# EAGLE design IR_ARRAY_IMG (EAGLE 7.7.0)

## Sheet 1 of 2
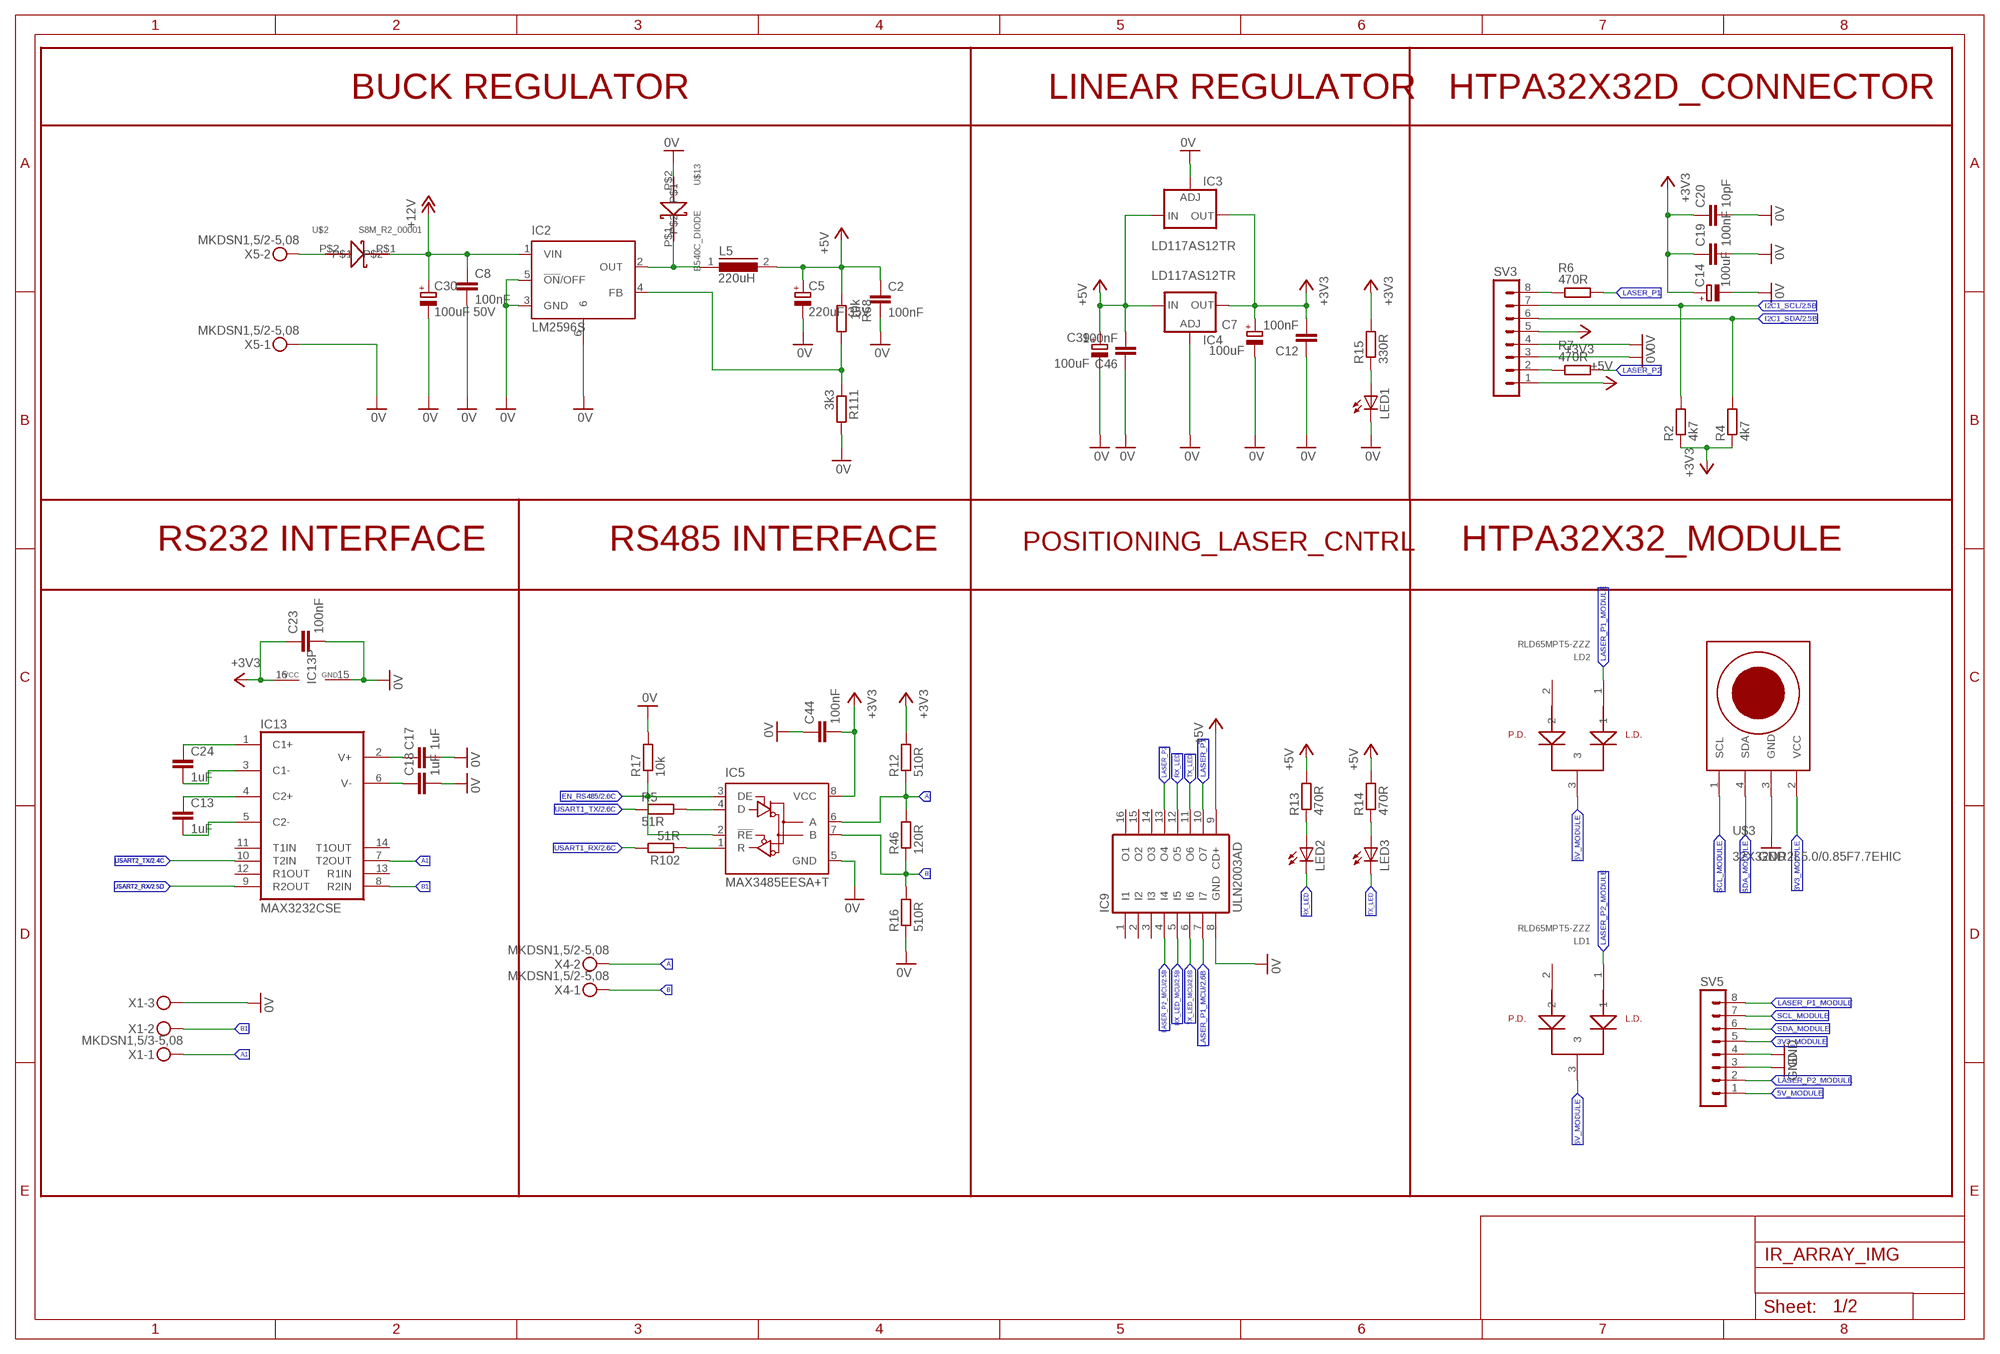
[diagram p0: schematic, sheet 1]

### Parts
C2  100nF  C-EUC0805  [C0805]
C5  220uF 35V  CPOL-EU153CLV-0810  [153CLV-0810]
C7  100uF  CPOL-EU153CLV-0605  [153CLV-0605]
C8  100nF  C-EUC0805  [C0805]
C12  100nF  C-EUC0603  [C0603]
C13  1uF  C-EUC1206  [C1206]
C14  100uF  CPOL-EUC/6032-28R  [C/6032-28R]
C17  1uF  C-EUC1206  [C1206]
C18  1uF  C-EUC1206  [C1206]
C19  100nF  C-EUC0603  [C0603]
C20  10pF  C-EUC0603  [C0603]
C23  100nF  C-EUC0603  [C0603]
C24  1uF  C-EUC1206  [C1206]
C30  100uF 50V  CPOL-EU153CLV-0810  [153CLV-0810]
C39  100uF  CPOL-EU153CLV-0605  [153CLV-0605]
C44  100nF  C-EUC0603  [C0603]
C46  100nF  C-EUC0603  [C0603]
IC2  LM2596S  [TO263-5]
IC3  LD117AS12TR  [SOT223]
IC4  LD117AS12TR  [SOT223]
IC5  MAX3485EESA+T  75176AD  [D_R-PDSO-G8]
IC9  ULN2003AD  [SO16]
IC13  MAX3232CSE  [SO16]
L5  220uH  DR125  [DR125]
LD1  RLD65MPT5-ZZZ  [RLD65MPT5-ZZZ]
LD2  RLD65MPT5-ZZZ  [RLD65MPT5-ZZZ]
LED1  LEDCHIPLED_0805  [CHIPLED_0805]
LED2  LEDCHIPLED_0805  [CHIPLED_0805]
LED3  LEDCHIPLED_0805  [CHIPLED_0805]
R2  4k7  R-EU_R0603  [R0603]
R4  4k7  R-EU_R0603  [R0603]
R5  51R  R-EU_R0603  [R0603]
R6  470R  R-EU_M0805  [M0805]
R7  470R  R-EU_M0805  [M0805]
R12  510R  R-EU_R0603  [R0603]
R13  470R  R-EU_R0603  [R0603]
R14  470R  R-EU_R0603  [R0603]
R15  330R  R-EU_R0603  [R0603]
R16  510R  R-EU_R0603  [R0603]
R17  10k  R-EU_R0603  [R0603]
R46  120R  R-EU_R0603  [R0603]
R68  10k  R-EU_M0805  [M0805]
R102  51R  R-EU_R0603  [R0603]
R111  3k3  R-EU_M0805  [M0805]
SV3  MA08-1  [MA08-1]
SV5  MA08-1  [MA08-1]
U$2  S8M_R2_00001  B540C_DIODE  [SMC]
U$3  32X32DR2L5.0/0.85F7.7EHIC  [32X32DR2L5.0/0.85F7.7EHIC]
U$13  B540C_DIODE  [SMC]
X1  MKDSN1,5/3-5,08  [MKDSN1,5/3-5,08]
X4  MKDSN1,5/2-5,08  [MKDSN1,5/2-5,08]
X5  MKDSN1,5/2-5,08  [MKDSN1,5/2-5,08]

### Nets
0V: C2.2 C5.- C7.- C8.2 C12.1 C14.- C17.2 C18.2 C19.2 C20.2 C23.2 C30.- C39.- C44.1 C46.1 IC2.3(GND) IC2.5(!ON!/OFF) IC2.6 IC3.1(ADJ) IC4.1(ADJ) IC5.5(GND) IC9.8(GND) IC13.15(GND) LED1.C R16.1 R17.2 R111.2 SV3.3 SV3.4 U$13.P$2 X1.3 X5.1 ; also sheet 2
3V3_MODULE: SV5.5 U$3.2(VCC)
5V_MODULE: LD1.3 LD2.3 SV5.1
+3V3: C7.+ C12.2 C14.+ C19.1 C20.1 C23.1 C44.2 IC3.4(OUT) IC4.4(OUT) IC5.8(VCC) IC13.16(VCC) R2.1 R4.1 R12.2 R15.2 SV3.5 ; also sheet 2
+5V: C2.1 C5.+ C39.+ C46.2 IC3.3(IN) IC4.3(IN) IC9.9(CD+) L5.2 R13.2 R14.2 R68.1 SV3.1
+12V: C8.1 C30.+ IC2.1(VIN) U$2.P$1
A: IC5.6(A) R12.1 R46.2 X4.2
A1: IC13.7(T2OUT) X1.1
B: IC5.7(B) R16.2 R46.1 X4.1
B1: IC13.8(R2IN) X1.2
EN_RS485: IC5.2(!RE) IC5.3(DE) R17.1 ; also sheet 2
GND: SV5.3 SV5.4 U$3.3(GND)
I2C1_SCL: R2.2 SV3.7 ; also sheet 2
I2C1_SDA: R4.2 SV3.6 ; also sheet 2
LASER_P1: IC9.10(O7) R6.2
LASER_P1_MCU: IC9.7(I7) ; also sheet 2
LASER_P1_MODULE: LD2.1 SV5.8
LASER_P2: IC9.13(O4) R7.2
LASER_P2_MCU: IC9.4(I4) ; also sheet 2
LASER_P2_MODULE: LD1.1 SV5.2
N$3: U$2.P$2 X5.2
N$4: C18.1 IC13.6(V-)
N$5: R7.1 SV3.2
N$6: R6.1 SV3.8
N$7: LED2.A R13.1
N$8: LED3.A R14.1
N$12: IC5.4(D) R5.2
N$14: LED1.A R15.1
N$45: C24.1 IC13.1(C1+)
N$54: C24.2 IC13.3(C1-)
N$62: IC5.1(R) R102.1
N$65: C13.1 IC13.4(C2+)
N$66: C13.2 IC13.5(C2-)
N$67: C17.1 IC13.2(V+)
N$216: IC2.2(OUT) L5.1 U$13.P$1
N$219: IC2.4(FB) R68.2 R111.1
RX_LED: IC9.12(O5) LED2.C
RX_LED_MCU: IC9.5(I5) ; also sheet 2
SCL_MODULE: SV5.7 U$3.1(SCL)
SDA_MODULE: SV5.6 U$3.4(SDA)
TX_LED: IC9.11(O6) LED3.C
TX_LED_MCU: IC9.6(I6) ; also sheet 2
USART1_RX: R102.2 ; also sheet 2
USART1_TX: R5.1 ; also sheet 2
USART2_RX: IC13.9(R2OUT) ; also sheet 2
USART2_TX: IC13.10(T2IN) ; also sheet 2
Unconnected: IC9.1(I1) IC9.2(I2) IC9.3(I3) IC9.14(O3) IC9.15(O2) IC9.16(O1) IC13.11(T1IN) IC13.12(R1OUT) IC13.13(R1IN) IC13.14(T1OUT) LD1.2 LD2.2

### Notes on the sheet
- BUCK REGULATOR | LINEAR REGULATOR | HTPA32X32D_CONNECTOR
- RS232 INTERFACE | RS485 INTERFACE | POSITIONING_LASER_CNTRL | HTPA32X32_MODULE

## Sheet 2 of 2
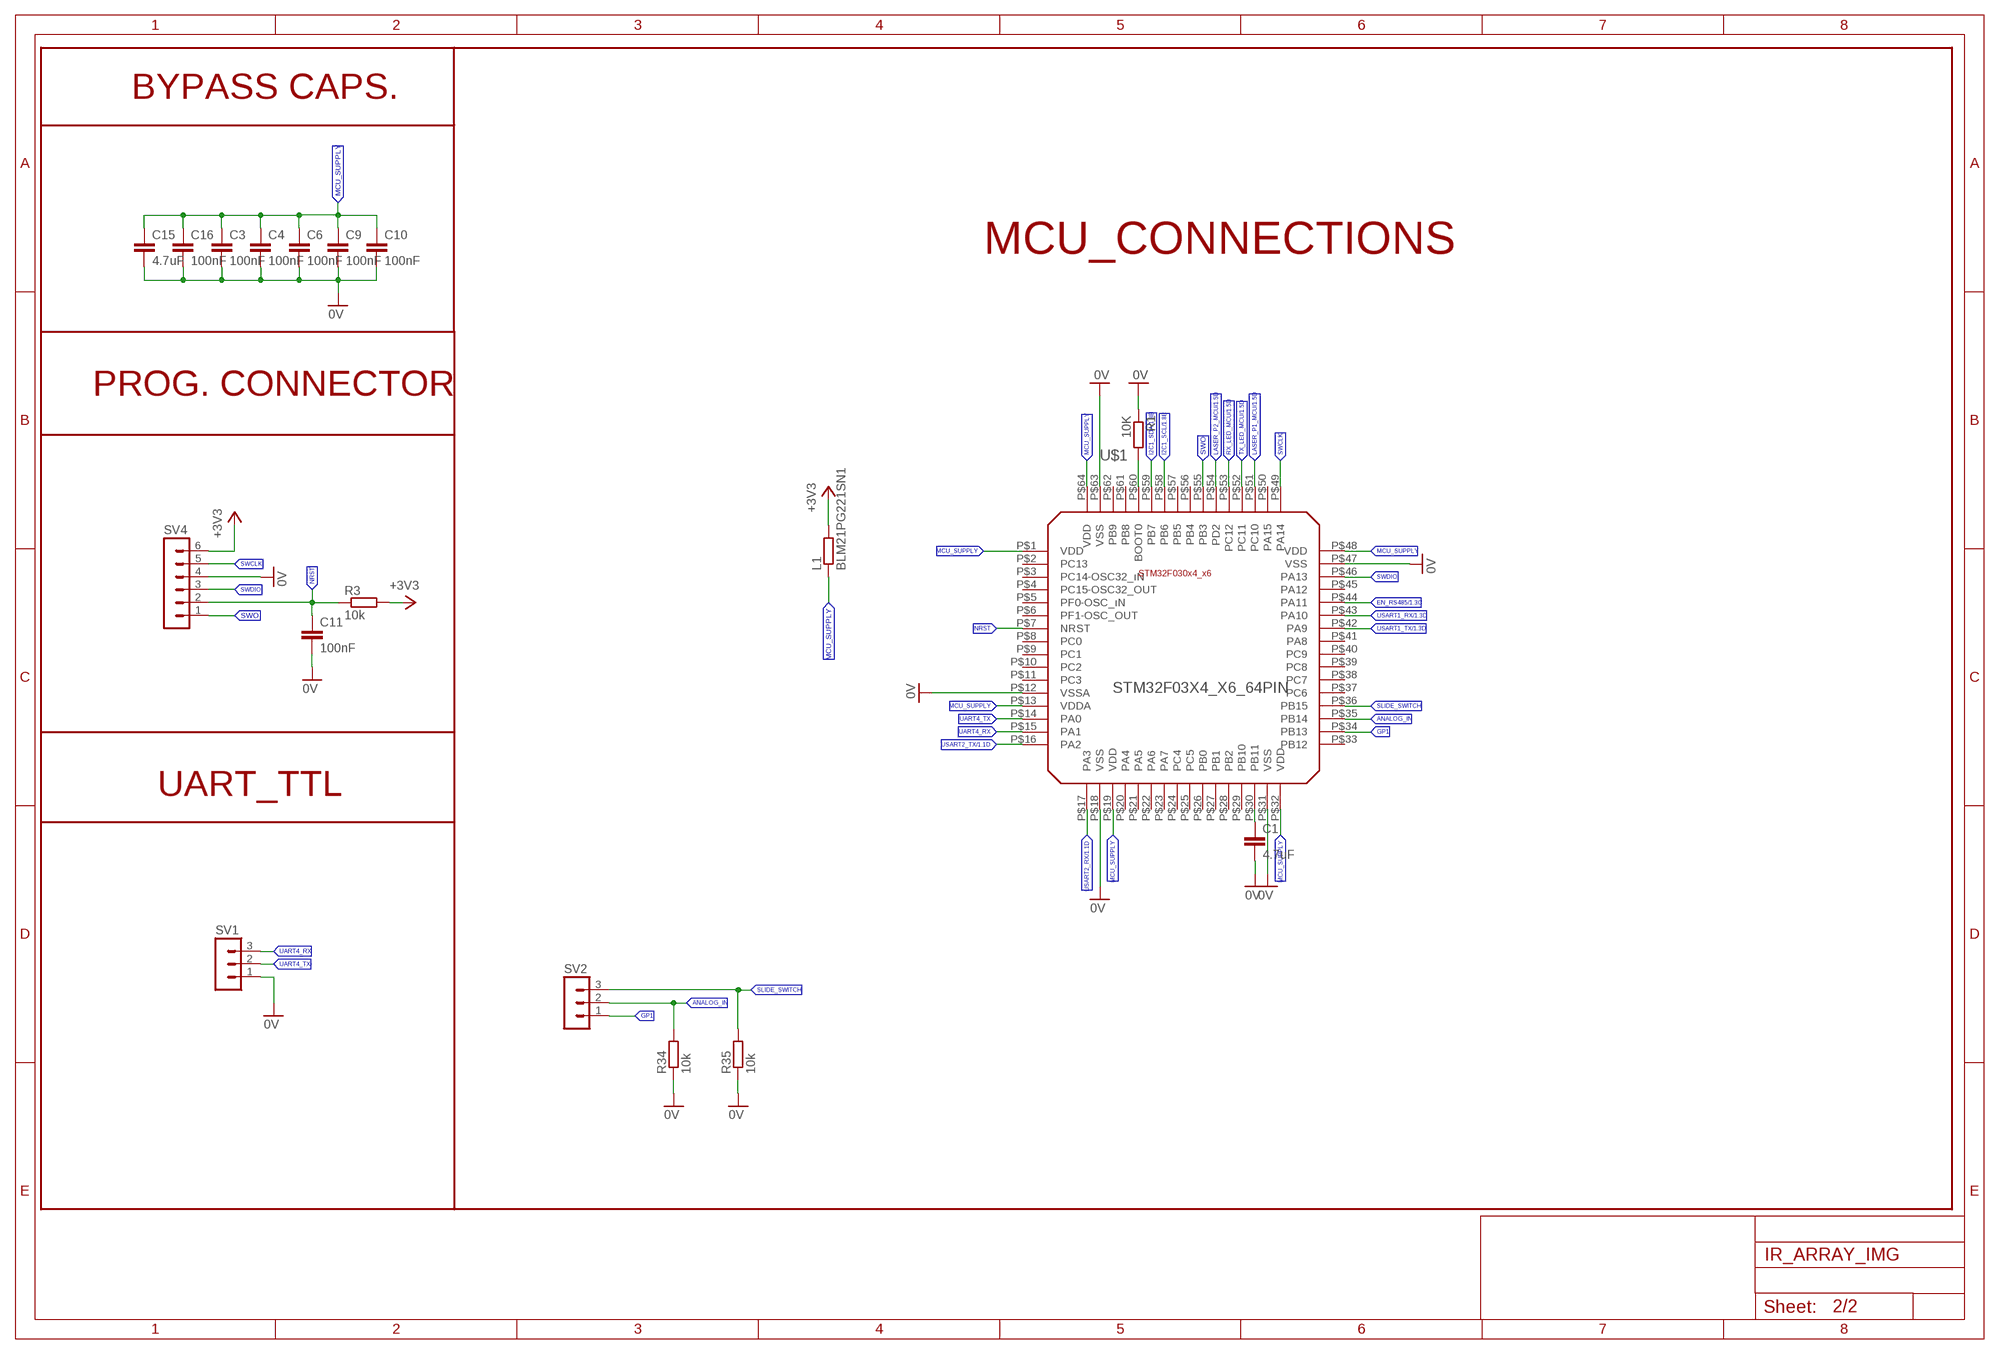
[diagram p1: schematic, sheet 2]

### Parts
C1  4.7uF  C-EUC0805  [C0805]
C3  100nF  C-EUC0603  [C0603]
C4  100nF  C-EUC0603  [C0603]
C6  100nF  C-EUC0603  [C0603]
C9  100nF  C-EUC0603  [C0603]
C10  100nF  C-EUC0603  [C0603]
C11  100nF  C-EUC0603  [C0603]
C15  4.7uF  C-EUC0805  [C0805]
C16  100nF  C-EUC0603  [C0603]
L1  BLM21PG221SN1  R-EU_R0805  [R0805]
R1  10K  R-EU_R0603  [R0603]
R3  10k  R-EU_R0603  [R0603]
R34  10k  R-EU_R0603  [R0603]
R35  10k  R-EU_R0603  [R0603]
SV1  MA03-1  [MA03-1]
SV2  MA03-1  [MA03-1]
SV4  MA06-1  [MA06-1]
U$1  STM32F03X4_X6_64PIN  [LQFP64]

### Nets
0V: C1.2 C3.2 C4.2 C6.2 C9.2 C10.2 C11.2 C15.2 C16.2 R1.1 R34.1 R35.1 SV1.1 SV4.4 U$1.P$12(VSSA) U$1.P$18(VSS) U$1.P$31(VSS) U$1.P$47(VSS) U$1.P$63(VSS) ; also sheet 1
+3V3: L1.2 R3.2 SV4.6 ; also sheet 1
ANALOG_IN: R34.2 SV2.2 U$1.P$35(PB14)
EN_RS485: U$1.P$44(PA11) ; also sheet 1
GP1: SV2.1 U$1.P$34(PB13)
I2C1_SCL: U$1.P$58(PB6) ; also sheet 1
I2C1_SDA: U$1.P$59(PB7) ; also sheet 1
LASER_P1_MCU: U$1.P$51(PC10) ; also sheet 1
LASER_P2_MCU: U$1.P$54(PD2) ; also sheet 1
MCU_SUPPLY: C3.1 C4.1 C6.1 C9.1 C10.1 C15.1 C16.1 L1.1 U$1.P$1(VDD) U$1.P$13(VDDA) U$1.P$19(VDD) U$1.P$32(VDD) U$1.P$48(VDD) U$1.P$64(VDD)
N$1: R1.2 U$1.P$60(BOOT0)
N$2: C1.1 U$1.P$30(PB11)
NRST: C11.1 R3.1 SV4.2 U$1.P$7(NRST)
RX_LED_MCU: U$1.P$53(PC12) ; also sheet 1
SLIDE_SWITCH: R35.2 SV2.3 U$1.P$36(PB15)
SWCLK: SV4.5 U$1.P$49(PA14)
SWDIO: SV4.3 U$1.P$46(PA13)
SWO: SV4.1 U$1.P$55(PB3)
TX_LED_MCU: U$1.P$52(PC11) ; also sheet 1
UART4_RX: SV1.3 U$1.P$15(PA1)
UART4_TX: SV1.2 U$1.P$14(PA0)
USART1_RX: U$1.P$43(PA10) ; also sheet 1
USART1_TX: U$1.P$42(PA9) ; also sheet 1
USART2_RX: U$1.P$17(PA3) ; also sheet 1
USART2_TX: U$1.P$16(PA2) ; also sheet 1
Unconnected: U$1.P$2(PC13) U$1.P$3(PC14-OSC32_ıN) U$1.P$4(PC15-OSC32_OUT) U$1.P$5(PF0-OSC_ıN) U$1.P$6(PF1-OSC_OUT) U$1.P$8(PC0) U$1.P$9(PC1) U$1.P$10(PC2) U$1.P$11(PC3) U$1.P$20(PA4) U$1.P$21(PA5) U$1.P$22(PA6) U$1.P$23(PA7) U$1.P$24(PC4) U$1.P$25(PC5) U$1.P$26(PB0) U$1.P$27(PB1) U$1.P$28(PB2) U$1.P$29(PB10) U$1.P$33(PB12) U$1.P$37(PC6) U$1.P$38(PC7) U$1.P$39(PC8) U$1.P$40(PC9) U$1.P$41(PA8) U$1.P$45(PA12) U$1.P$50(PA15) U$1.P$56(PB4) U$1.P$57(PB5) U$1.P$61(PB8) U$1.P$62(PB9)

### Notes on the sheet
- BYPASS CAPS.
- MCU_CONNECTIONS
- PROG. CONNECTOR
- UART_TTL

## Library data of the parts
C1-C4 C6 C8-C13 C15-C20 C23 C24 C44 C46 = rcl:C-EU: CAPACITOR, European symbol
C5 C7 C14 C30 C39 = rcl:CPOL-EU: POLARIZED CAPACITOR, European symbol
IC2 = Aktif_Lib:LM2596: SIMPLE SWITCHER® Power Converter 150 kHz 3A Step-Down Voltage Regulator Source: http://www.national.com/ds/LM/LM2596.pdf; MF: NATIONAL SEMICONDUCTOR; MPN: LM2596S-ADJ/NOPB; OC_FARNELL: 9494367; OC_NEWARK: 41K3842
IC3 IC4 = v-reg:LD117A?*: Low drop fixed and adjustable positive voltage regulators 1 A Source: http://www.st.com/stonline/products/literature/ds/7194/ld1117axx.pdf
IC5 = 751xx:75176A: DIFFERENTIAL BUS TRANSCEIVER Source: http://focus.ti.com/lit/ds/symlink/sn75176a.pdf
IC9 = uln-udn:ULN2003A: DRIVER ARRAY
IC13 = maxim:MAX3232*: True RS-232 Transceivers 3.0V to 5.5V, Low-Power up to 1Mbps, Using Four 0.1µF External Capacitors Source: http://pdfserv.maxim-ic.com/en/ds/MAX3222-MAX3241.pdf; MPN: MAX3232CSE; OC_FARNELL: 9725490; OC_NEWARK: 90C2890
L1 R1-R7 R12-R17 R34 R35 R46 R68 R102 R111 = rcl:R-EU_: RESISTOR, European symbol
L5 = inductors:DR125: High Power Density, High Efficiency, Shielded Inductors Source: coiltronics_dr_series.pdf
LD1 LD2 = Alihan_1:RLD65MPT5-ZZZ
LED1-LED3 = led:LED: LED OSRAM: - CHIPLED LG R971, LG N971, LY N971, LG Q971, LY Q971, LO R971, LY R971 LH N974, LH R974 LS Q976, LO Q976, LY Q976 LO Q996 - Hyper CHIPLED LW Q18S LB Q993, LB Q99A, LB R99A - SideLED LS A670, LO A670, LY A670, LG A670, LP A670 LB A673, LV A673, LT A673, LW A673 LH A674 LY A675 LS A676, LA A676, LO A676, LY A676, LW A676 LS A679, LY A679, LG A679 - Hyper Micro SIDELED® LS Y876, LA Y876, LO Y876, LY Y876 LT Y87S - SmartLED LW L88C, LW L88S LB L89C, LB L89S, LG L890 LS L89K, LO L89K, LY L89K LS L896, LA L896, LO L896, LY L896 - TOPLED LS T670, LO T670, LY T670, LG T670, LP T670 LSG T670, LSP T670, LSY T670, LOP T670, LYG T670 LG T671, LOG T671, LSG T671 LB T673, LV T673, LT T673, LW T673 LH T674 LS T676, LA T676, LO T676, LY T676, LB T676, LH T676, LSB T676, LW T676 LB T67C, LV T67C, LT T67C, LS T67K, LO T67K, LY T67K, LW E67C LS E67B, LA E67B, LO E67B, LY E67B, LB E67C, LV E67C, LT E67C LW T67C LS T679, LY T679, LG T679 LS T770, LO T770, LY T770, LG T770, LP T770 LB T773, LV T773, LT T773, LW T773 LH T774 LS E675, LA E675, LY E675, LS T675 LS T776, LA T776, LO T776, LY T776, LB T776 LHGB T686 LT T68C, LB T68C - Hyper Mini TOPLED® LB M676 - Mini TOPLED Santana® LG M470 LS M47K, LO M47K, LY M47K Source: http://www.osram.convergy.de LUXEON: - LUMILED® LXK2-PW12-R00, LXK2-PW12-S00, LXK2-PW14-U00, LXK2-PW14-V00 LXK2-PM12-R00, LXK2-PM12-S00, LXK2-PM14-U00 LXK2-PE12-Q00, LXK2-PE12-R00, LXK2-PE12-S00, LXK2-PE14-T00, LXK2-PE14-U00 LXK2-PB12-K00, LXK2-PB12-L00, LXK2-PB12-M00, LXK2-PB14-N00, LXK2-PB14-P00, LXK2-PB14-Q00 LXK2-PR12-L00, LXK2-PR12-M00, LXK2-PR14-Q00, LXK2-PR14-R00 LXK2-PD12-Q00, LXK2-PD12-R00, LXK2-PD12-S00 LXK2-PH12-R00, LXK2-PH12-S00 LXK2-PL12-P00, LXK2-PL12-Q00, LXK2-PL12-R00 Source: www.luxeon.com KINGBRIGHT: KA-3528ASYC Source: www.kingbright.com
SV1 SV2 = con-lstb:MA03-1: PIN HEADER; OC_FARNELL: unknown; OC_NEWARK: unknown
SV3 SV5 = con-lstb:MA08-1: PIN HEADER; OC_FARNELL: unknown; OC_NEWARK: unknown
SV4 = con-lstb:MA06-1: PIN HEADER; OC_FARNELL: unknown; OC_NEWARK: unknown
U$1 = Alihan_1_lib:STM32F03X4_X6_64PIN
U$2 U$13 = Alihan_1_lib:B540C_DIODE
U$3 = Alihan_1:32X32DR2L5.0/0.85F7.7EHIC
X1 = con-phoenix-508:MKDSN1,5/3-5,08: MKDSN 1,5/ 3-5,08 Printklemme Nennstrom: 13,5 A Nennspannung: 250 V Rastermaß: 5,08 mm Polzahl: 3 Anschlussart: Schraubanschluss Montage: Löten Anschlussrichtung Leiter/Platine: 0 ° Artikelnummer: 1729131 Source: http://eshop.phoenixcontact.com .. 1729131.pdf
X4 X5 = con-phoenix-508:MKDSN1,5/2-5,08: MKDSN 1,5/ 2-5,08 Printklemme Nennstrom: 13,5 A Nennspannung: 250 V Rastermaß: 5,08 mm Polzahl: 2 Anschlussart: Schraubanschluss Montage: Löten Anschlussrichtung Leiter/Platine: 0 ° Artikelnummer: 1729128 Source: http://eshop.phoenixcontact.com .. 1729128.pdf

## Board
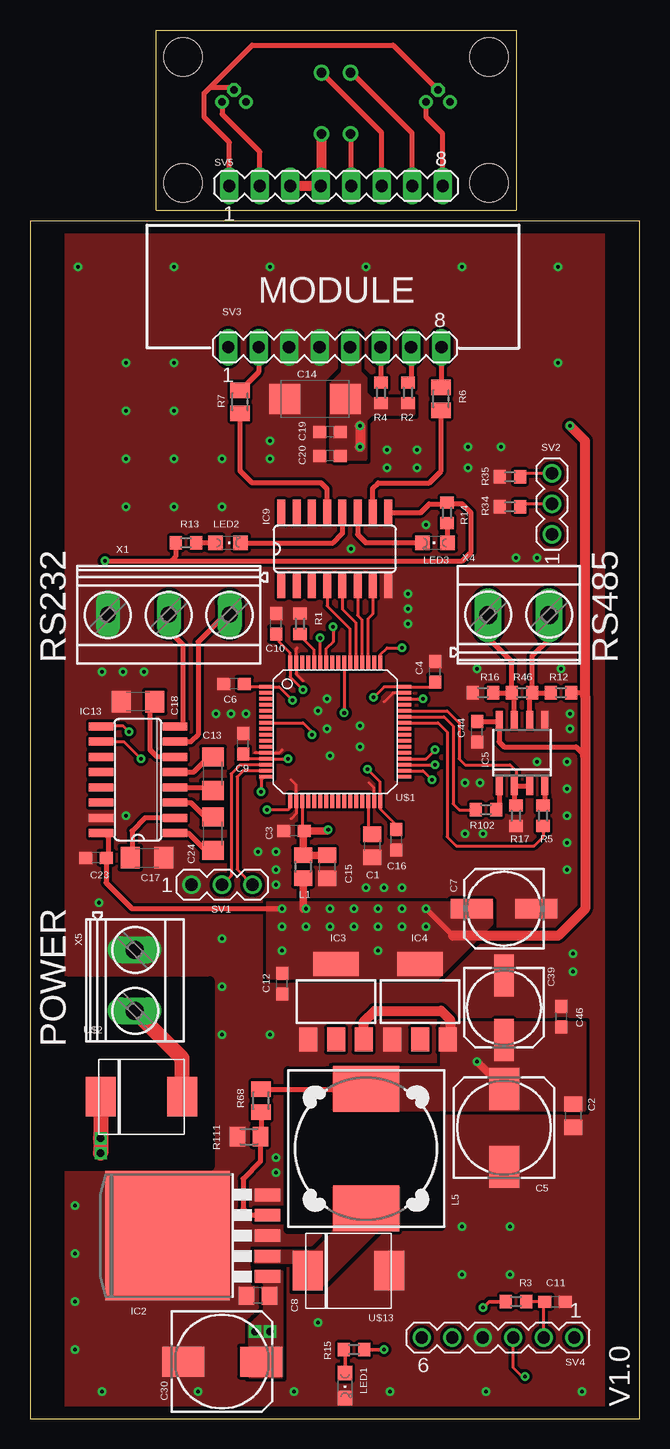
[diagram p2: board, top side]
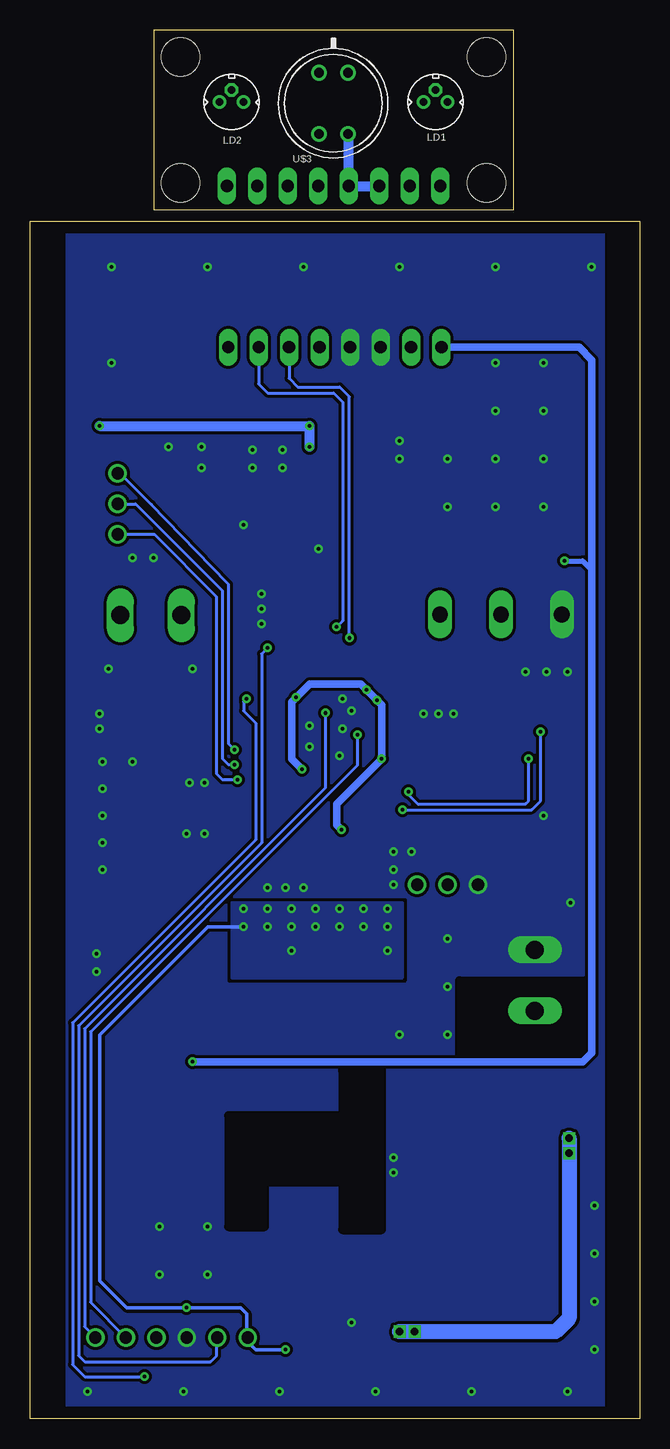
[diagram p3: board, bottom side, seen from below]

Size 50.8 x 115.75 mm. Coordinates in mm from the lower left corner, seen from the top.
Outline: 0,0 50.8,0 50.8,99.8 0,99.8 0,0
Outline: 10.5,100.75 40.5,100.75 40.5,115.75 10.5,115.75 10.5,100.75
Copper layers (1*16): Top 0.035mm / dielectric 1.5mm / Bottom 0.035mm
Design rules "default": minimum track width 10mil, minimum drill 24mil, track to track 8mil, track to pad 8mil, pad to pad 8mil, via to via 8mil, smd to smd 8mil, copper to edge 40mil, drill to drill 8mil, minimum pad ring 10mil, minimum via ring 8mil, stop-mask expansion 4mil, vias tented up to drill 0mil, thermal gap 10mil
Holes 3.2 mm at 12.75,113.5 38.25,113.5 12.75,103 38.25,103
tRestrict: area 3,21 to 15,36.5; area 21.5,15.8 to 34.2,29
bRestrict: area 21.5,15.8 to 34.2,29; area 4.5,30.2 to 15,36.5

### Footprints (pad centres in the part's own frame; a part is rotated, then mirrored left to right if it is on the bottom)
C0805 = smd 1.3 x 1.5: 1 -0.95,0; 2 0.95,0
C0603 = smd 1.1 x 1: 1 -0.85,0; 2 0.85,0
153CLV-0810 = smd 3.5 x 2.5: + 3.25,0; - -3.25,0
153CLV-0605 = smd 3.5 x 1.6: + 2.7,0; - -2.7,0
C1206 = smd 1.6 x 1.8: 1 -1.4,0; 2 1.4,0
C/6032-28R = smd 2.55 x 2.5: + 2.525,0; - -2.525,0
TO263-5 = smd 1.067 x 2.159: 1 -3.404,-5.791; 2 -1.702,-5.791; 3 0,-5.791; 4 1.702,-5.791; 5 3.404,-5.791 | smd 10.8 x 10.41: 6 0,2.54
SOT223 = smd 1.5 x 2: 1 -2.3,-3.15; 2 0,-3.15; 3 2.3,-3.15 | smd 3.8 x 2: 4 0,3.15
D_R-PDSO-G8 = smd 0.6 x 1.5: 1 -1.905,-2.75; 2 -0.635,-2.75; 3 0.635,-2.75; 4 1.905,-2.75; 5 1.905,2.75; 6 0.635,2.75; 7 -0.635,2.75; 8 -1.905,2.75
SO16 = smd 0.66 x 2.032: 1 -4.445,-3.073; 2 -3.175,-3.073; 3 -1.905,-3.073; 4 -0.635,-3.073; 5 0.635,-3.073; 6 1.905,-3.073; 7 3.175,-3.073; 8 4.445,-3.073; 9 4.445,3.073; 10 3.175,3.073; 11 1.905,3.073; 12 0.635,3.073; 13 -0.635,3.073; 14 -1.905,3.073; 15 -3.175,3.073; 16 -4.445,3.073
R0805 = smd 1.3 x 1.5: 1 -0.95,0; 2 0.95,0
DR125 = smd 3.85 x 5.5: 1 -4.975,0; 2 4.975,0
RLD65MPT5-ZZZ = drill 0.6: 1 1,0; 2 -1,0 | drill 0.6 octagon: 3 0,1
CHIPLED_0805 = smd 1.2 x 1.2: A 0,-1.05; C 0,1.05
R0603 = smd 1 x 1.1: 1 -0.85,0; 2 0.85,0
M0805 = smd 1.3 x 1.6: 1 -0.95,0; 2 0.95,0
MA03-1 = drill 1.016: 1 -2.54,0; 2 0,0; 3 2.54,0
MA08-1 = drill 1.016 long: 1 -8.89,0; 2 -6.35,0; 3 -3.81,0; 4 -1.27,0; 5 1.27,0; 6 3.81,0; 7 6.35,0; 8 8.89,0
MA06-1 = drill 1.016: 1 -6.35,0; 2 -3.81,0; 3 -1.27,0; 4 1.27,0; 5 3.81,0; 6 6.35,0
LQFP64 = smd 1.2 x 0.3: P$1 -5.715,3.75; P$2 -5.715,3.25; P$3 -5.715,2.75; P$4 -5.715,2.25; P$5 -5.715,1.75; P$6 -5.715,1.25; P$7 -5.715,0.75; P$8 -5.715,0.25; P$9 -5.715,-0.25; P$10 -5.715,-0.75; P$11 -5.715,-1.25; P$12 -5.715,-1.75; P$13 -5.715,-2.25; P$14 -5.715,-2.75; P$15 -5.715,-3.25; P$16 -5.715,-3.75; P$33 5.785,-3.75; P$34 5.785,-3.25; P$35 5.785,-2.75; P$36 5.785,-2.25; P$37 5.785,-1.75; P$38 5.785,-1.25; P$39 5.785,-0.75; P$40 5.785,-0.25; P$41 5.785,0.25; P$42 5.785,0.75; P$43 5.785,1.25; P$44 5.785,1.75; P$45 5.785,2.25; P$46 5.785,2.75; P$47 5.785,3.25; P$48 5.785,3.75 | smd 0.3 x 1.2: P$17 -3.715,-5.75; P$18 -3.215,-5.75; P$19 -2.715,-5.75; P$20 -2.215,-5.75; P$21 -1.715,-5.75; P$22 -1.215,-5.75; P$23 -0.715,-5.75; P$24 -0.215,-5.75; P$25 0.285,-5.75; P$26 0.785,-5.75; P$27 1.285,-5.75; P$28 1.785,-5.75; P$29 2.285,-5.75; P$30 2.785,-5.75; P$31 3.285,-5.75; P$32 3.785,-5.75; P$49 3.785,5.75; P$50 3.285,5.75; P$51 2.785,5.75; P$52 2.285,5.75; P$53 1.785,5.75; P$54 1.285,5.75; P$55 0.785,5.75; P$56 0.285,5.75; P$57 -0.215,5.75; P$58 -0.715,5.75; P$59 -1.215,5.75; P$60 -1.715,5.75; P$61 -2.215,5.75; P$62 -2.715,5.75; P$63 -3.215,5.75; P$64 -3.715,5.75
SMC = smd 2.5 x 3.3: P$1 -3.62,-0.18; P$2 3.18,-0.18
32X32DR2L5.0/0.85F7.7EHIC = drill 0.8: 1 -1.21,2.44; 2 -1.21,-2.66; 3 1.21,-2.66; 4 1.21,2.44
MKDSN1,5/3-5,08 = drill 1.3 pad 2 long: 1 -7.645,-0.021; 2 -2.565,-0.021; 3 2.515,-0.021
MKDSN1,5/2-5,08 = drill 1.5 pad 2 long: 1 -2.565,-0.021; 2 2.515,-0.021

### Placement (x,y rotation side)
C1  28.5,47.75 270 top
C2  45.25,25.25 270 top
C3  22,49 180 top
C4  33.75,62.25 90 top
C5  39.5,24.25 90 top
C6  17,61.25 180 top
C7  39.5,42.5 180 top
C8  19,10.25 180 top
C9  17.75,56.25 90 top
C10  20.5,66.25 90 top
C11  43.75,9.75 0 top
C12  21,36.25 90 top
C13  15.25,53.75 90 top
C14  23.75,85 0 top
C15  24.75,46 270 top
C16  30.5,48.25 270 top
C17  9.75,46.75 0 top
C18  9,59.75 180 top
C19  25,82.25 180 top
C20  25,80.25 180 top
C23  5.5,46.75 180 top
C24  15.25,48.75 90 top
C30  16,4.75 0 top
C39  39.5,34.25 270 top
C44  37.25,57.25 90 top
C46  44.25,33.5 270 top
IC2  14,15.25 90 top
IC3  25.5,34.75 0 top
IC4  32.5,34.75 0 top
IC5  41,55.5 0 top
IC9  25.4,72.5 0 top
IC13  9,53.25 90 top
L1  22.75,46 270 top
L5  28,22.5 90 top
LD1  17,109.75 0 bottom
LD2  34,109.75 0 bottom
LED1  26.25,2.75 180 top
LED2  16.5,73 270 top
LED3  33.75,73 90 top
R1  22.5,66.25 270 top
R2  31.5,85.5 90 top
R3  40.5,9.75 180 top
R4  29.25,85.5 90 top
R5  42.75,50.25 90 top
R6  34.25,85 270 top
R7  17.5,84.75 270 top
R12  44.25,60.5 0 top
R13  13,73 180 top
R14  34.75,75.5 90 top
R15  27,5.75 0 top
R16  37.75,60.5 0 top
R17  40.5,50.25 270 top
R34  40,76 0 top
R35  40,78.5 0 top
R46  41,60.5 0 top
R68  19.25,26.5 270 top
R102  38,50.75 180 top
R111  18.25,23.5 180 top
SV1  16,44.5 0 top
SV2  43.5,76.25 90 top
SV3  25.4,89.3 0 top
SV4  39,6.75 180 top
SV5  25.5,102.75 0 top
U$1  25.4,57.25 0 top
U$2  9.5,27 0 top
U$3  25.5,109.75 0 bottom
U$13  26.75,12.5 0 top
X1  9,67 180 top
X4  40.75,67 0 top
X5  8.75,36.5 270 top

### Tracks (layer width: path | path; a pad name or v marks a point on that pad's centre or on a via)
0V  (via drill 0.3)
  Top 0.254: 21.75,50 22.18,50.44 U$1.P$18 22.18,52.81 21.75,53.25 | U$1.P$31 28.68,52.56 28.25,53 | U$1.P$47 30.25,60.5 29.5,59.75 | 18.75,55.5 U$1.P$12 20.75,55.5 21,55.75 | 22.25,64.25 22.18,64.19 U$1.P$63 22.18,62.06 22.75,61.5
  other vias: 45,58.75 45,57.5 36.25,53 37.5,53 36.25,48.75 37.75,48.75 16.75,58.75 18,58.75 15.5,58.75 28,44.25 29.5,44.25 31,44.25 44.75,45.75 44.75,48 45.25,37.25 45.25,38.75 24.75,60 24,59 24.75,57.5 27.5,57.75 27.5,56 25,55.25 4,96 28,96 12,96 36,96 20,96 44,96 44,88 8,84 8,76 8,80 12,76 12,80 12,84 16,76 16,80 20,80 8,88 12,88 20,81.5 29.75,80.75 32.25,80.75 32.25,79.25 29.75,79.25 36.5,81 39.25,81 36.5,79.25 33,74.5 26.75,72.5 40.5,71.75 42.25,71.75 37.25,62.5 44.25,62.5 31.5,66.25 31.5,67.5 31.5,68.75 6,62.25 7.75,62.25 9.5,62.25 20.5,44.5 20.5,45.75 20.5,47.25 19,47.25 5.75,43 8,50.25 44.75,54.75 42.25,54.75 44.75,52.5 44.75,50.25 20.5,20.5 20.5,21.75 6,2.25 14,2.25 22,2.25 30,2.25 38,2.25 46,2.25 36,12 40,12 40,16 36,16 24,8 20,32 16,32 16,36 16,40 3.75,5.75 3.75,9.75 3.75,13.75 3.75,17.75
  pour Top (isolate 0.254, rank 2, no thermals): 3,99.75 47.75,99.75 47.75,0 3,0
  pour Bottom (isolate 0.254, rank 2, no thermals): 3,99.75 47.75,99.75 47.75,0 3,0
3V3_MODULE
  Top 0.406: SV5.5 26.77,106.67 U$3.2
5V_MODULE
  Top 0.406: SV5.1 16.61,106.39 14.5,108.5 14.5,110.5 15,111 | 15,111 16.75,111 LD1.3 | 15,111 18.5,114.5 30.25,114.5 LD2.3
+3V3  (via drill 0.3)
  Top 0.305: R3.2 38.25,9.75 v37.75,9.25 | v29.5,5.75 R15.2
  Top 0.406: IC13.16 6.2,48.8 6.5,48.5 6.5,46.9 C23.1 6.35,44.65 8.5,42.5 v21,42.5 | 35.25,40.25 v33,42.5 | 46.25,60.25 46,60.5 R12.2 | 46.25,55.25 45.5,56 39.5,56 39.09,56.41 IC5.8 38.95,58.1 C44.2
  Top 0.61: L1.2 22.75,42.5 v23,42.5
  Top 0.813: 35.25,40.25 44,40.25 46.25,42.5 46.25,55.25 46.25,60.25 46.25,81.5 v45,82.75 | v27.5,82.75 v27.5,81
  Bottom 0.305: v33,41 36,41 45,32 45,11.5 42.75,9.25 v37.75,9.25 33.25,9.25 32.75,8.75 32.75,6.85 SV4.6 32.65,6.4 32,5.75 v29.5,5.75
  Bottom 0.813: v45,82.75 v27.5,82.75 v27.5,81
  other vias: 21,41 23,41 25,41 25,42.5 21,39 27,41 27,42.5 29,42.5 29,41 29,39 31,41 31,42.5
  pour Top (isolate 0.254, no thermals): 26,90.25 26,87.25 25,86.25 25,80 28,80 28,83.25 28.5,83.75 32,83.75 32,85 28.5,85 28,85.5 28,86.75 27.5,87.25 27.5,90.25 27.25,90.5 26.25,90.5
  pour Top (isolate 0.254, no thermals): 19.75,36.75 34,36.75 38.5,41.25 38.5,43 19.75,43
  pour Bottom (isolate 0.254, no thermals): 19.75,43 34,43 34,36.75 19.75,36.75
+5V  (via drill 0.3)
  Top 0.406: R68.1 27.98,27.45 L5.2 | v6.25,71.5 11.75,71.5 | 11.75,71.5 36,71.5 36.75,72.25 36.75,75.5 36,76.25 34.85,76.25 R14.2 34.65,76.25 33.25,76.25 32.5,75.5 29.92,75.5 IC9.9 | R13.2 12.15,71.9 11.75,71.5
  Top 0.61: C5.+ v37.25,29.75
  Top 0.813: IC3.3 27.8,33.05 28.75,34 34.25,34 35,33.25 35,31.8 IC4.3
  Bottom 0.406: v6.25,71.5 4.75,71.5 4,70.75
  Bottom 0.61: v37.25,29.75 4.75,29.75 4,30.5 4,70.75 4,88.25 5.05,89.3 SV3.1
  pour Top (isolate 0.254, no thermals): 25.25,29.25 25.25,25.75 46.25,25.75 46.25,33 34.25,33 34.25,29.25
+12V  (via drill 0.6)
  Top 1.27: U$2.P$1 5.88,25.57 | 5.88,25.57 v5.88,23.37 | 5.88,25.57 v5.88,22.12
  Bottom 1.27: v5.88,23.37 5.88,8.37 7,7.25 v18.75,7.25 v20,7.25
  pour Top (isolate 0.254, no thermals): 18.75,12.25 18.75,11.5 19.25,11.5 19.5,11.25 19.5,9 18.75,8.25 18.5,8 18.25,7.75 18.25,3.5 21,3.5 21,12.25
A
  Top 0.406: R46.2 R12.1 | R46.2 41.85,63.6 43.25,65 43.25,66.96 X4.2 | IC5.6 41.63,60.28 R46.2
A1
  Top 0.406: X1.1 16.27,67.02 14,64.75 14,57 13.43,56.42 IC13.7
ANALOG_IN  (via drill 0.3)
  Top 0.254: U$1.P$35 v33.75,54.5 | SV2.2 41.1,76.25 R34.2
  Bottom 0.254: v33.75,54.5 34.25,54.5 34.75,55 34.75,69 42,76.25 SV2.2
B
  Top 0.406: R16.2 R46.1 | R46.1 40.15,63.1 38.25,65 38.25,66.91 X4.1 | IC5.7 40.37,60.28 R46.1
B1
  Top 0.406: IC13.8 12.45,57.7 12.75,58 12.75,64.5 11.56,65.69 X1.2
EN_RS485
  Top 0.254: U$1.P$44 34.75,59 35.75,58 35.75,55 36.25,54.5 40,54.5 40.5,54 40.5,52.88 IC5.2
  Top 0.406: R17.1 40.37,51.23 IC5.2 IC5.3
GND
  Top 0.813: U$3.3 24.29,102.79 24.25,102.75 21.5,102.75
  Bottom 0.813: U$3.3 24.29,102.81 SV5.4 SV5.3
GP1  (via drill 0.3)
  Top 0.254: U$1.P$34 32.75,54 v33.5,53.25
  Bottom 0.254: v33.5,53.25 34.75,53.25 35.25,53.75 35.25,68.5 40.46,73.71 SV2.1
I2C1_SCL  (via drill 0.3)
  Top 0.254: v25.25,66 25.25,64.75 24.68,64.19 U$1.P$58
  Top 0.406: SV3.7 31.75,86.6 R2.2
  Bottom 0.254: SV3.7 31.75,86.25 31,85.5 25.5,85.5 24.75,84.75 24.75,66.5 v25.25,66
I2C1_SDA  (via drill 0.3)
  Top 0.254: U$1.P$59 v24.18,65.06
  Top 0.406: SV3.6 29.21,86.39 R4.2
  Bottom 0.254: SV3.6 29.21,86.71 28.5,86 25,86 24.18,85.19 v24.18,65.06
LASER_P1
  Top 0.406: IC9.10 28.57,77.58 29,78 33.25,78 34.25,79 R6.2
LASER_P1_MCU
  Top 0.254: U$1.P$51 28.18,66.69 28.57,67.08 IC9.7
LASER_P1_MODULE
  Top 0.406: SV5.8 34.39,107.11 33,108.5 LD2.1
LASER_P2
  Top 0.406: IC9.13 24.77,77.48 24.25,78 18.5,78 17.5,79 R7.2
LASER_P2_MCU
  Top 0.254: IC9.4 24.77,67.73 26.68,65.81 U$1.P$54
LASER_P2_MODULE
  Top 0.406: SV5.2 19.15,105.6 16,108.75 LD1.1
MCU_SUPPLY  (via drill 0.3)
  Top 0.254: C16.1 30.5,49.5 29.18,50.81 U$1.P$32 29.18,53.06 v28.12,54.12 | C9.1 18.15,55 U$1.P$13 v21.5,55 | C6.1 18.1,61 U$1.P$1 20.75,61 v21.88,59.88 | C10.1 20.75,65.15 20.75,64.75 21.68,63.81 U$1.P$64 21.68,61.81 v22.75,60.75 | C4.1 33.35,61 U$1.P$48 29.5,61 v28.62,60.12 | U$1.P$19 22.68,49.16
  Top 0.305: 22.68,49.16 C3.1
  Top 0.61: C15.1 L1.1 22.75,48.9 C3.1 24.75,49 v24.85,49.1
  Bottom 0.61: v24.85,49.1 25.25,49.5 25.25,51.25 v21.5,55 21.5,59.5 v21.88,59.88 v22.75,60.75 23.25,61.25 27.5,61.25 v28.62,60.12 29,59.75 29,55 v28.12,54.12
N$1
  Top 0.254: U$1.P$60 23.68,64.06 22.75,65 22.75,65.15 R1.2
N$2
  Top 0.254: U$1.P$30 28.18,48.77 C1.1
N$3
  Top 1.27: U$2.P$2 12.68,30.03 X5.2
N$4
  Top 0.406: IC13.6 10.6,55.16 10,55.75 10,59.35 C18.1
N$5
  Top 0.406: SV3.2 19.05,87.25 R7.1
N$6
  Top 0.406: SV3.8 34.29,85.99 R6.1
N$7
  Top 0.406: LED2.A R13.1
N$8
  Top 0.406: R14.1 34.75,72.8 LED3.A
N$12
  Top 0.406: IC5.4 42.91,51.26 R5.2
N$14
  Top 0.305: LED1.A 26.25,5.65 R15.1
N$45
  Top 0.406: IC13.1 13.2,48.8 14.65,47.35 C24.1
N$54
  Top 0.406: IC13.3 13.4,51.34 14.6,50.15 C24.2
N$62
  Top 0.406: IC5.1 39.09,50.99 R102.1
N$65
  Top 0.406: IC13.4 14.98,52.62 C13.1
N$66
  Top 0.406: IC13.5 13.63,53.88 14.9,55.15 C13.2
N$67
  Top 0.406: IC13.2 9.57,50.08 8.5,49 8.5,46.9 C17.1
N$216
  pour Top (isolate 0.254, no thermals): 18.75,14 23.75,14 25.25,15.5 25.25,19.25 30.75,19.25 30.75,16 29.25,16 24.25,11 24.25,10.75 22,10.75 22,13 18.75,13
N$219
  Top 0.406: R68.2 19.25,23.55 R111.1 19.2,21.45 17.75,20 17.75,17.5 18.3,16.95 IC2.4
NRST  (via drill 0.3)
  Top 0.254: U$1.P$7 22.75,58 23.5,57.25 v23.5,57 | SV4.2 42.81,9.66 C11.1 R3.1
  Bottom 0.254: v23.5,57 23.5,54.5 45.75,32.25 45.75,9.69 SV4.2
RX_LED
  Top 0.406: LED2.C 25.25,73 26.04,73.78 IC9.12
RX_LED_MCU
  Top 0.254: U$1.P$53 27.18,66.31 26.04,67.47 IC9.5
SCL_MODULE
  Top 0.406: SV5.7 31.85,107.15 26.71,112.29 U$3.1
SDA_MODULE
  Top 0.406: SV5.6 29.31,107.19 24.29,112.21 U$3.4
SLIDE_SWITCH  (via drill 0.3)
  Top 0.254: v33.75,55.75 33,55 U$1.P$36 | SV2.3 41.14,78.79 R35.2
  Bottom 0.254: SV2.3 43.29,78.79 40.69,76.19 34.36,69.63 34.25,69.52 34.25,56.25 v33.75,55.75
SWCLK  (via drill 0.3)
  Top 0.254: U$1.P$49 29.18,63.69 29.75,64.25 v31,64.25
  Bottom 0.254: v31,64.25 31.5,63.75 31.5,48 46.75,32.75 46.75,5.25 46.25,4.75 35.75,4.75 35.25,5.25 35.25,6.69 SV4.5
SWDIO  (via drill 0.3)
  Top 0.254: U$1.P$46 v32.75,60 | v41.25,3.5 41,3.5 40.25,4.25 40.25,6.73 SV4.3
  Bottom 0.254: v32.75,60 33,59.75 33,59 32,58 32,48.25 47.25,33 47.25,4.5 46.25,3.5 v41.25,3.5
SWO  (via drill 0.3)
  Top 0.254: U$1.P$55 v26.18,58.81
  Bottom 0.254: v26.18,58.81 26.18,52.56 46.25,32.5 46.25,7.65 SV4.1
TX_LED
  Top 0.406: LED3.C 28,73 27.3,73.69 IC9.11
TX_LED_MCU
  Top 0.254: U$1.P$52 27.68,66.56 27.3,66.94 IC9.6
UART4_RX
  Top 0.254: U$1.P$15 17.75,54 17.25,53.5 17.25,45.79 SV1.3
UART4_TX
  Top 0.254: U$1.P$14 17.5,54.5 16.75,53.75 16.75,45.25 SV1.2
USART1_RX
  Top 0.254: U$1.P$43 34.5,58.5 35.25,57.75 35.25,51.25 35.75,50.75 R102.2
USART1_TX
  Top 0.254: U$1.P$42 34,58 34.75,57.25 34.75,48.5 35.5,47.75 42,47.75 42.75,48.5 R5.1
USART2_RX  (via drill 0.3)
  Top 0.254: U$1.P$17 21.68,50.94 21.5,50.75 v19.75,50.75 | v8.25,57.25 7.75,57.75 5.98,57.75 IC13.9
  Bottom 0.254: v19.75,50.75 9,50.75 8.25,51.5 v8.25,57.25
USART2_TX  (via drill 0.3)
  Top 0.254: U$1.P$16 19.5,53.5 19.25,53.25 v19.25,52.25 | v9.25,55 7.83,56.42 IC13.10
  Bottom 0.254: v19.25,52.25 19.25,52 18.5,51.25 9.5,51.25 9.25,51.5 v9.25,55

### Text on the board
tPlace: MODULE | RS232 | RS485 | POWER | V1.0
tDocu: AL-053